# Altium schematic sheet Sheet1.SchDoc
size A3; SheetNumber: 1; SheetTotal: 1
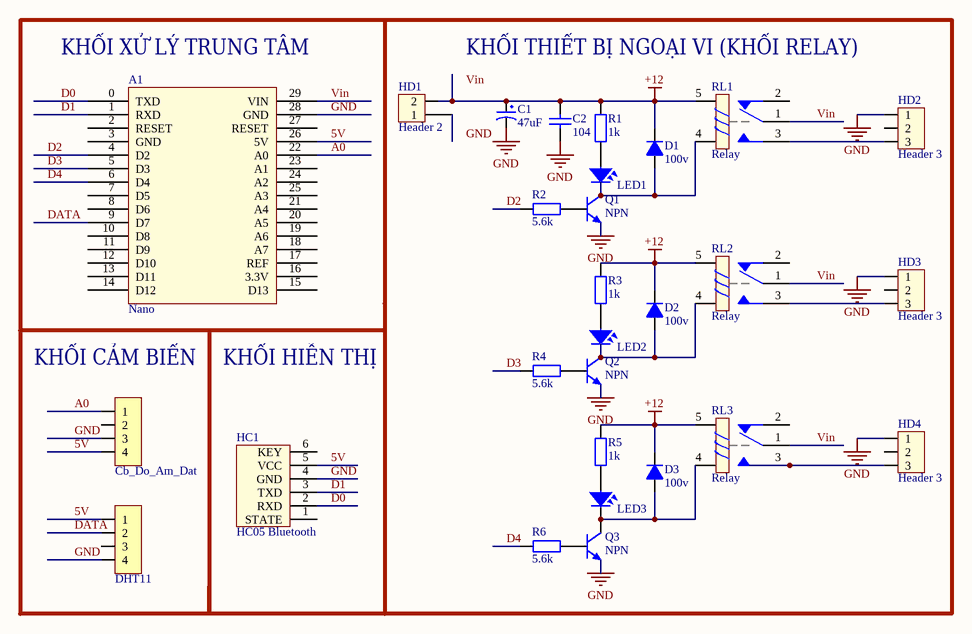
[diagram p0: Sheet1.SchDoc]

## Parts
A1  Nano  [Arduino nano]
C1  47uF  [tu hoa 5mm]
C2  104  [tu gom]
D1  100v  [DIODE 1A]
D2  100v  [DIODE 1A]
D3  100v  [DIODE 1A]
HC1  HC05 Bluetooth  [HC05 Bluethooth Dung]
HD1  Header 2  [HED2]
HD2  Header 3  [HED3]
HD3  Header 3  [HED3]
HD4  Header 3  [HED3]
JP3  Cb_Do_Am_Dat  [JP 1x4 CT]
JP4  DHT11  [JP 1x4 CT]
LED1  LED  [LED-3]  (value not drawn)
LED2  LED  [LED-3]  (value not drawn)
LED3  LED  [LED-3]  (value not drawn)
Q1  NPN  [TRAN-LOWPOWER]
Q2  NPN  [TRAN-LOWPOWER]
Q3  NPN  [TRAN-LOWPOWER]
R1  1k  [tro vach 1/4w]
R2  5.6k  [tro vach 1/4w]
R3  1k  [tro vach 1/4w]
R4  5.6k  [tro vach 1/4w]
R5  1k  [tro vach 1/4w]
R6  5.6k  [tro vach 1/4w]
RL1  Relay  [Relay 5 Chan SRD]
RL2  Relay  [Relay 5 Chan SRD]
RL3  Relay  [Relay 5 Chan SRD]

## Nets
+12: C1.1 C2.1 D1.2(K) D2.2(K) D3.2(K) HD1.2 R1.1 R3.1 R5.1 RL1.5 RL2.5 RL3.5
GND: A1.28(GND) C1.2 C2.2 HC1.4(GND) HD2.1 HD3.1 HD4.1 JP3.3 JP4.4 Q1.3(E) Q2.3(E) Q3.3(E)
5V: A1.26(5V) HC1.5(VCC) JP3.4 JP4.1
A0: A1.22(A0) JP3.1
D0: A1.0(TXD) HC1.2(RXD)
D1: A1.1(RXD) HC1.3(TXD)
D2: A1.4(D2) R2.2
D3: A1.5(D3) R4.2
D4: A1.6(D4) R6.2
DATA: A1.9(D7) JP4.2
Vin: A1.29(VIN) RL1.1 RL2.1 RL3.1
NetD1_1: D1.1(A) LED1.2 Q1.2(C) RL1.4
NetD2_1: D2.1(A) LED2.2 Q2.2(C) RL2.4
NetD3_1: D3.1(A) LED3.2 Q3.2(C) RL3.4
NetHD2_3: HD2.3 RL1.3
NetHD3_3: HD3.3 RL2.3
NetHD4_3: HD4.3 RL3.3
NetLED1_1: LED1.1 R1.2
NetLED2_1: LED2.1 R3.2
NetLED3_1: LED3.1 R5.2
NetQ1_1: Q1.1(B) R2.1
NetQ2_1: Q2.1(B) R4.1
NetQ3_1: Q3.1(B) R6.1

Not connected (* = marked no-connect by the designer): A1 2(RESET) 3(GND) 7(D5) 8(D6) 10(D8) 11(D9) 12(D10) 13(D11) 14(D12) 15(D13) 16(3.3V) 17(REF) 18(A7) 19(A6) 20(A5) 21(A4) 23(A1) 24(A2) 25(A3) 27(RESET); HC1 1(STATE) 6(KEY); HD1 1; HD2 2; HD3 2; HD4 2; JP3 2; JP4 3; RL1 2; RL2 2; RL3 2

## Notes on the sheet
- (near A1) KHỐI XỬ LÝ TRUNG TÂM
- KHỐI THIẾT BỊ NGOẠI VI (KHỐI RELAY)
- KHỐI CẢM BIẾN
- KHỐI HIỄN THỊ
- Labels drawn without touching a wire or pin: GND, Vin

## Library data of the parts
A1 = Arduino Nano
C1 = Tu Hoa 47uF 25V 5x8: Cắm; Don_Vi: Con; So_Chan: 2; Ten_Linh_Kien: Tụ Hóa 47uF 25V; Ma_Hang: MH006860; Chung_Loai: Cắm; Kieu_Chan: *
C2 = Tu gom 104 50V: Cắm; So_Chan: 2; Ten_Linh_Kien: Tụ gốm 104 100nF 50V; Don_Vi: Con; Ma_Hang: MH004761; Chung_Loai: Cắm; Kieu_Chan: *
D1-D3 = Diode 1N4007: Cắm; Ten_Linh_Kien: Diode 1N4007 1A (DIP); Don_Vi: Con; Ma_Hang: MH001063; Ghi Chu: *; Kieu_Chan: *; Chung_Loai: Cắm
HC1 = HC05 Bluetooth: Bluetooth HC05; Value: Connector 6
HD1 = Hed2: Header 2 (Green); Value: Header 2
HD2-HD4 = Hed3: Header 3 (Green); Value: Header 3
JP3 JP4 = JP 1x4 2.54 Cai Thang: Cắm; Ten_Linh_Kien: Jump Đơn Cái 2.54MM 1x20P Thẳng; Don_Vi: Con; Ma_Hang: MH004006; Ghi_Chu: *; Kieu_Chan: *; Chung_Loai: Cắm
LED1-LED3 = LED: LED Single colour Green and Red; Value: LED 3 ly Single Colour
Q1-Q3 = NPN: NPN General; Published: 8-Jun-2000; LatestRevisionDate: 15-Jan-2003; LatestRevisionNote: PCB Footprint 'BCY-W3/D4.7' replaced; DatasheetDocument: 1997; PackageDocument: Sep-1998; PackageReference: TO-92A; Publisher: Altium Limited; Code_JEDEC: TO-92A; ComponentLink1Description: Manufacturer Link; ComponentLink1URL: http://www.fairchildsemi.com/; ComponentLink2Description: Datasheet; ComponentLink2URL: http://www.fairchildsemi.com/ds/2N%2F2N3904.pdf
R1-R6 = Tro Vach 1/4W 5% 5.6k: Cắm; Don_Vi: Con; So_Chan: 2; Ten_Linh_Kien: Trở Vạch 1/4w 5% 5.6k; Ma_Hang: MH007323; Chung_Loai: Cắm; Kieu_Chan: *
RL1-RL3 = Relay 5 Chan SRD: Relay 5 Chan; Ma_Hang: MH009374; Ten: Relay 5V10A SRD-05VDC-SL-C Chính Hãng